# EAGLE schematic source_eagle (EAGLE 9.6.2)
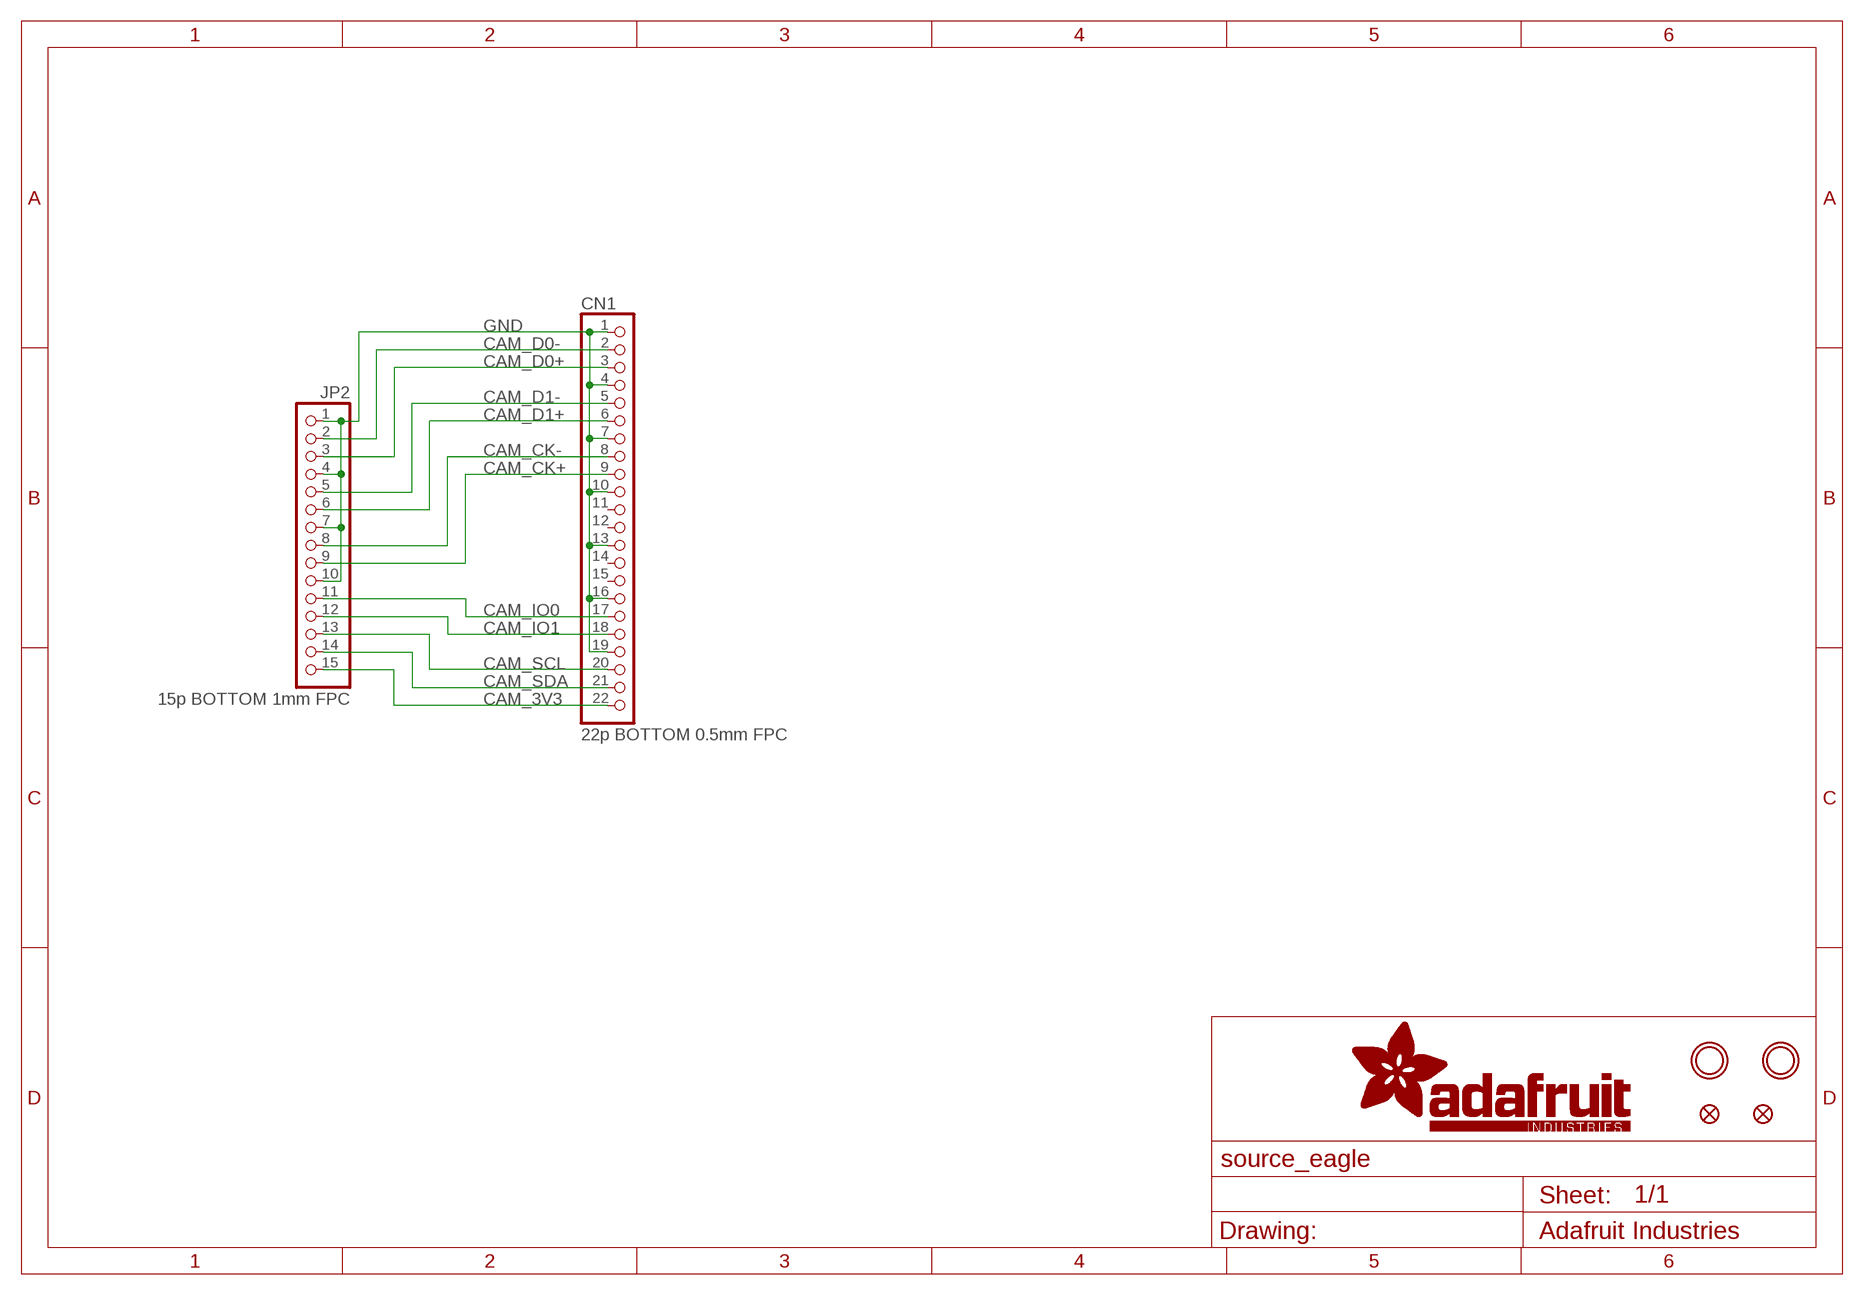
[diagram p0: schematic, sheet 1]

## Parts
CN1  22p BOTTOM 0.5mm FPC  HEADER-1X22_22PIN_0.5MM_BOT  [FPC_22PIN]
FID1  FIDUCIAL_1MM  [FIDUCIAL_1MM]
FID2  FIDUCIAL_1MM  [FIDUCIAL_1MM]
JP2  15p BOTTOM 1mm FPC  HEADER-1X15_FPC1MM_PI  [FPC_15PIN_1.0MM]
U$2  MOUNTINGHOLE2.5  [MOUNTINGHOLE_2.5_PLATED]
U$3  MOUNTINGHOLE2.5  [MOUNTINGHOLE_2.5_PLATED]

## Nets
CAM_3V3: CN1.22 JP2.15
CAM_CK+: CN1.9 JP2.9
CAM_CK-: CN1.8 JP2.8
CAM_D0+: CN1.3 JP2.3
CAM_D0-: CN1.2 JP2.2
CAM_D1+: CN1.6 JP2.6
CAM_D1-: CN1.5 JP2.5
CAM_IO0: CN1.17 JP2.11
CAM_IO1: CN1.18 JP2.12
CAM_SCL: CN1.20 JP2.13
CAM_SDA: CN1.21 JP2.14
GND: CN1.1 CN1.4 CN1.7 CN1.10 CN1.13 CN1.16 CN1.19 JP2.1 JP2.4 JP2.7 JP2.10
Unconnected: CN1.11 CN1.12 CN1.14 CN1.15

## Library data of the parts
CN1 = adafruit_electromech:HEADER-1X22
FID1 FID2 = microbuilder:FIDUCIAL: Fiducial Alignment Points Various fiducial points for machine vision alignment.; BOM: EXCLUDE
JP2 = adafruit_electromech:HEADER-1X15: 1x15 Header
U$2 U$3 = adafruit_electromech:MOUNTINGHOLE: Mounting Hole For #2 screws (0.086"/2.18mm width, 0.094"/2.4mm hole) use 2.5mm; BOM: EXCLUDE